# Altium project typec版下载器PCB_Project.PrjPcb
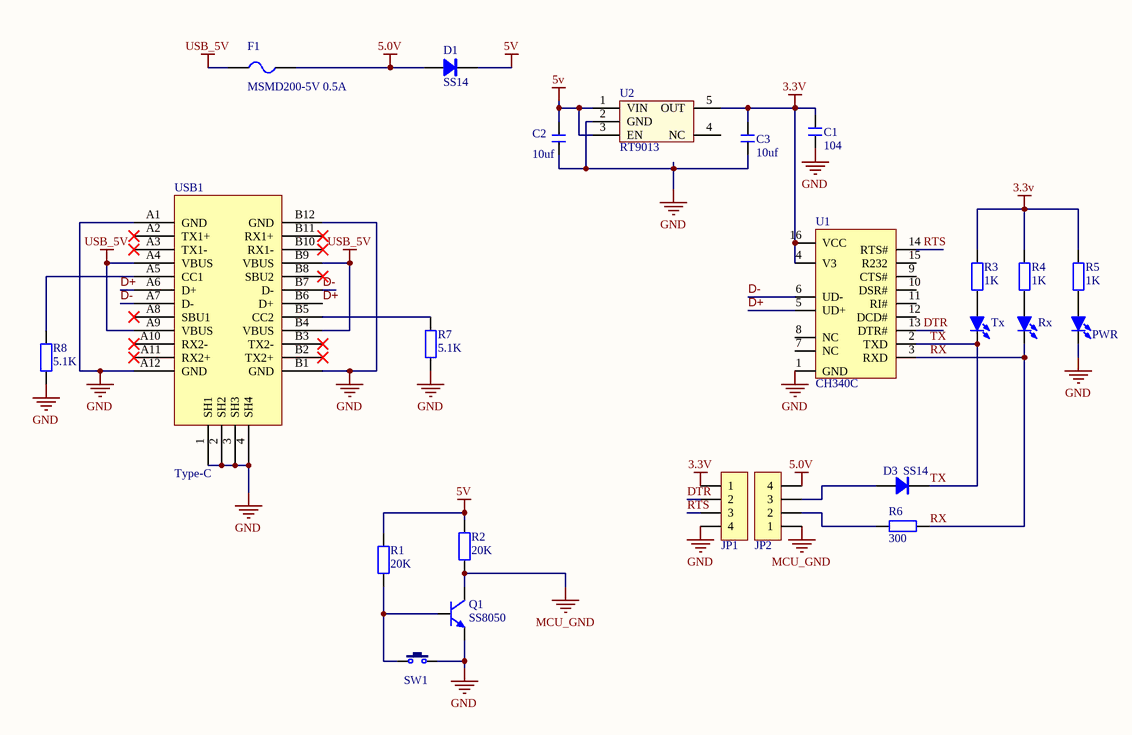
[diagram p0: typec版原理图.SchDoc]
1 sheet, 24 parts. Net scope: global (net labels, ports and power ports of the same name join across sheets).
Board file: PCB1.PcbDoc

## Sheet typec版原理图.SchDoc
size A4; SheetNumber: 1; SheetTotal: 1

### Parts
C1  104  [C 0603_L]
C2  10uf  [C 0603_L]
C3  10uf  [C 0603_L]
D1  SS14  [SOD-323]
D3  SS14  [SOD-323]
F1  MSMD200-5V 0.5A  [FU 0603]
JP1  HDR-1X4  [2.54_WSPIN_4PIN]  (value not drawn)
JP2  HDR-1X4  [2.54_WSPIN_4PIN]  (value not drawn)
LED1  Tx  [LED 0603B]
LED2  Rx  [LED 0603B]
LED3  PWR  [LED 0603B]
Q1  SS8050  [SOT23-3L]
R1  20K  [R 0603_L]
R2  20K  [R 0603_L]
R3  1K  [R 0603_L]
R4  1K  [R 0603_L]
R5  1K  [R 0603_L]
R6  300  [R 0603_L]
R7  5.1K  [R 0603_L]
R8  5.1K  [R 0603_L]
SW1  3x6x5  [SW_1]  (value not drawn)
U1  CH340C  [SOP16_N]
U2  RT9013  [SOT23-5M]
USB1  Type-C  [Type-C-TOP]

### Nets
3.3v: C1.2 C3.2 JP1.1 R3.2 R4.2 R5.2 U1.4(V3) U1.16(VCC) U2.5(OUT)
5.0V: D1.1(A) F1.2 JP2.4
5v: C2.2 D1.2(K) R1.2 R2.2 U2.1(VIN) U2.3(EN)
GND: C1.1 C2.1 C3.1 JP1.4 LED3.2(K) Q1.2(E) R7.1 R8.1 SW1.1 U1.1(GND) U2.2(GND) USB1.1(SH1) USB1.2(SH2) USB1.3(SH3) USB1.4(SH4) USB1.A1(GND) USB1.A12(GND) USB1.B1(GND) USB1.B12(GND)
MCU_GND: JP2.1 Q1.3(C) R2.1
USB_5V: F1.1 USB1.A4(VBUS) USB1.A9(VBUS) USB1.B4(VBUS) USB1.B9(VBUS)
D+: U1.5(UD+) USB1.A6(D+) USB1.B6(D+)
D-: U1.6(UD-) USB1.A7(D-) USB1.B7(D-)
DTR: JP1.2 U1.13(DTR#)
RTS: JP1.3 U1.14(RTS#)
RX: LED2.2(K) R6.2 U1.3(RXD)
TX: D3.2(K) LED1.2(K) U1.2(TXD)
NetD3_1: D3.1(A) JP2.3
NetJP2_2: JP2.2 R6.1
NetLED1_1: LED1.1(A) R3.1
NetLED2_1: LED2.1(A) R4.1
NetLED3_1: LED3.1(A) R5.1
NetQ1_1: Q1.1(B) R1.1 SW1.2
NetR7_2: R7.2 USB1.B5(CC2)
NetR8_2: R8.2 USB1.A5(CC1)

Not connected (* = marked no-connect by the designer): U1 7(NC) 8(NC) 9(CTS#) 10(DSR#) 11(RI#) 12(DCD#) 15(R232); U2 4(NC); USB1 A2(TX1+)* A3(TX1-)* A8(SBU1)* A10(RX2-)* A11(RX2+)* B2(TX2+)* B3(TX2-)* B8(SBU2)* B10(RX1-)* B11(RX1+)*

### Library data of the parts
C1-C3 = C: 无极性贴片电容; 版权归属: 源创客; BOM名称: 无极性贴片电容; 学习资源: www.ooocke.com
D1 D3 = SS14: 肖特基二极管; 版权归属: 源创客; 属性: 40V/1A; BOM名称: 肖特基二极管; 学习资源: www.ooocke.com
F1 = FU: 贴片保险丝; 版权归属: 源创客; BOM名称: 贴片保险丝; 学习资源: www.ooocke.com
JP1 JP2 = Header 4: 4P接插件; 版权归属: 源创客; BOM名称: 4P接插件; 学习资源: www.ooocke.com
LED1-LED3 = LED-SMD: 贴片LED; 版权归属: 源创客; BOM名称: 贴片LED; 学习资源: www.ooocke.com
Q1 = 8050-SMD: 高频放大-NPN型; 版权归属: 源创客; 属性: 40V 1.5A 1W 100MHZ; BOM名称: 高频放大-NPN型; 学习资源: www.ooocke.com
R1-R8 = R: 贴片电阻; 版权归属: 源创客; BOM名称: 贴片电阻; 学习资源: www.ooocke.com
SW1 = TSW 3x6: 3x6轻触开关; 版权归属: 源创客; BOM名称: 3x6轻触开关; 学习资源: www.ooocke.com
U2 = RT9013_500ma_lDO
USB1 = USB-Type-C-TOP